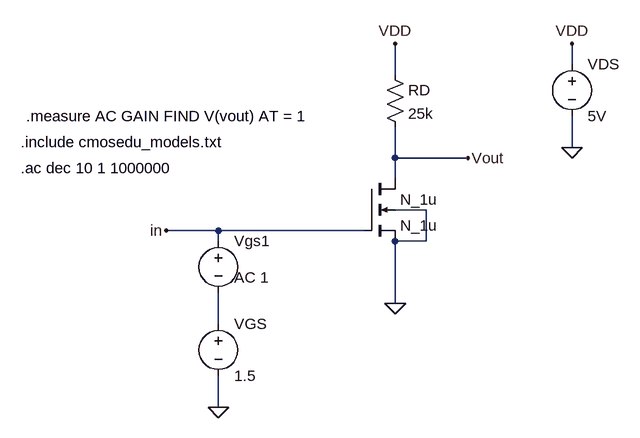
[diagram p0: schematic parte1.asc]
parte1.asc, the LTspice schematic file:
Version 4
SHEET 1 880 680
WIRE 608 -224 608 -256
WIRE 336 -208 336 -256
WIRE 608 -96 608 -144
WIRE 336 -80 336 -128
WIRE 448 -80 336 -80
WIRE 336 -48 336 -80
WIRE 384 0 336 0
WIRE 64 32 -16 32
WIRE 288 32 64 32
WIRE 64 48 64 32
WIRE 384 48 384 0
WIRE 384 48 336 48
WIRE 336 144 336 48
WIRE 64 176 64 128
WIRE 64 304 64 256
FLAG 336 144 0
FLAG 64 304 0
FLAG 448 -80 Vout
FLAG -16 32 in
FLAG 336 -256 VDD
FLAG 608 -96 0
FLAG 608 -256 VDD
SYMBOL voltage 64 32 R0
WINDOW 3 24 44 Left 2
WINDOW 123 24 72 Left 2
WINDOW 39 0 0 Left 2
SYMATTR Value ""
SYMATTR Value2 AC 1
SYMATTR InstName Vgs1
SYMBOL voltage 64 160 R0
WINDOW 123 0 0 Left 2
WINDOW 39 0 0 Left 2
SYMATTR InstName VGS
SYMATTR Value 1.5
SYMBOL nmos4 288 -48 R0
SYMATTR InstName N_1u
SYMATTR Value N_1u
SYMATTR Value2 l=1.5u w=3u
SYMBOL res 320 -224 R0
SYMATTR InstName RD
SYMATTR Value 25k
SYMBOL voltage 608 -240 R0
WINDOW 123 0 0 Left 2
WINDOW 39 0 0 Left 2
SYMATTR InstName VDS
SYMATTR Value 5V
TEXT -240 -104 Left 2 !.include cmosedu_models.txt
TEXT -240 -64 Left 2 !.ac dec 10 1 1000000
TEXT -232 -144 Left 2 !.measure AC GAIN FIND V(vout) AT = 1

The netlist it stands for:
* parte1.asc
Vgs1 in N001 AC 1
VGS N001 0 1.5
M§N_1u Vout in 0 0 N_1u l=1.5u w=3u
RD VDD Vout 25k
VDS VDD 0 5V
.model NMOS NMOS
.model PMOS PMOS
.lib standard.mos
.include cmosedu_models.txt
.ac dec 10 1 1000000
.measure AC GAIN FIND V(vout) AT = 1
.backanno
.end